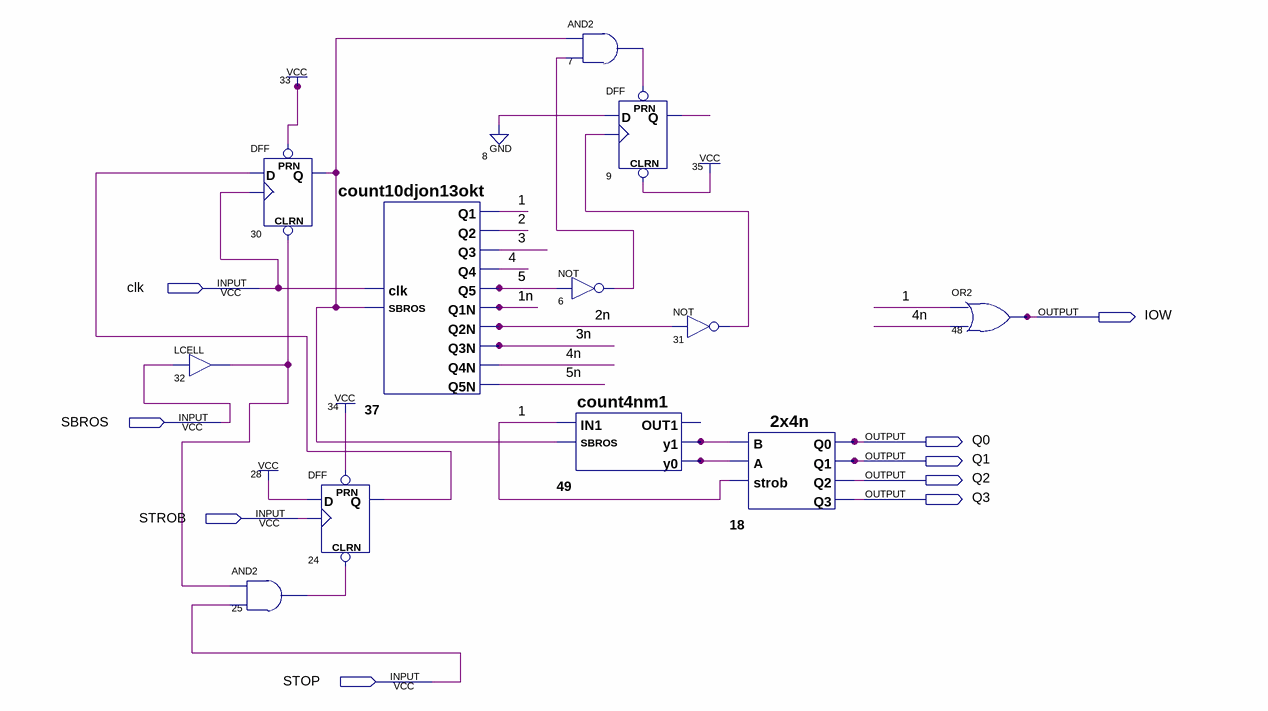
[diagram p0: schematic sheet]
// Quartus schematic raspred2_19des.bdf as structural Verilog: 12 symbols, 9 pins
module raspred2_19des (
  input  clk,
  input  SBROS,
  input  STROB,
  input  STOP,
  output IOW,
  output Q0,
  output Q1,
  output Q2,
  output Q3
);

  wire \1 , \1n , \2 , \2n , \3 , \3n , \4 , \4n , \5 , \5n , n6_out, n7_out, n9_q, n24_q, n25_out, n30_q,
       n31_out, n32_out, n49_y0, n49_y1;

  LCELL u_32 (.IN(SBROS), .OUT(n32_out));
  and u_25 (n25_out, n32_out, STOP);
  DFF u_30 (.CLRN(n32_out), .CLK(clk), .D(n24_q), .PRN(1'b1), .Q(n30_q));
  DFF u_24 (.CLRN(n25_out), .CLK(STROB), .D(1'b1), .PRN(1'b1), .Q(n24_q));
  count10djon13okt u_37 (
    .clk(clk), .SBROS(n30_q), .Q1(\1 ), .Q2(\2 ), .Q3(\3 ), .Q4(\4 ), .Q5(\5 ), .Q1N(\1n ), .Q2N(\2n ),
    .Q3N(\3n ), .Q4N(\4n ), .Q5N(\5n ));
  and u_7 (n7_out, n30_q, n6_out);
  DFF u_9 (.CLRN(1'b1), .CLK(n31_out), .D(1'b0), .PRN(n7_out), .Q(n9_q));
  not u_6 (n6_out, \5 );
  count4nm1 u_49 (.IN1(\1 ), .SBROS(n30_q), .y1(n49_y1), .y0(n49_y0));  // open: OUT1
  not u_31 (n31_out, \2n );
  \2x4n  u_18 (.B(n49_y1), .A(n49_y0), .strob(\1 ), .Q0(Q0), .Q1(Q1), .Q2(Q2), .Q3(Q3));
  or u_48 (IOW, \1 , \4n );
endmodule
